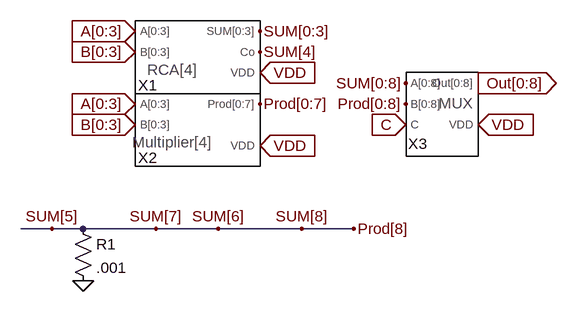
[diagram p0: schematic ALU_ADD_MUL.asc]
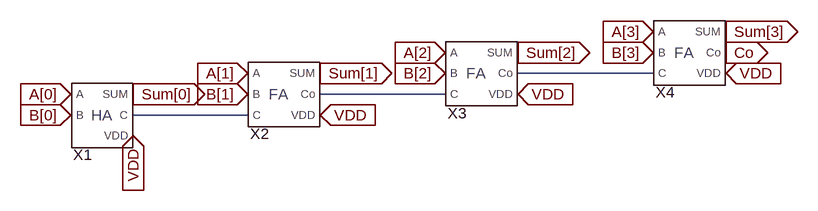
[diagram p1: sub-circuit rca[4].asc]
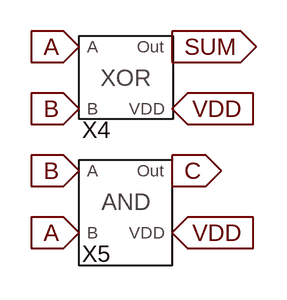
[diagram p2: sub-circuit half_adder.asc]
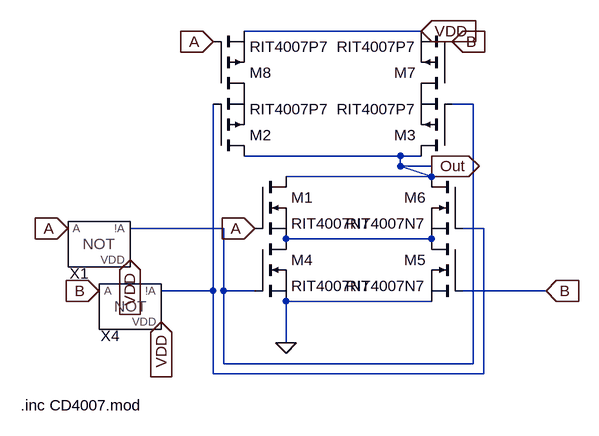
[diagram p3: sub-circuit gate_xor.asc]
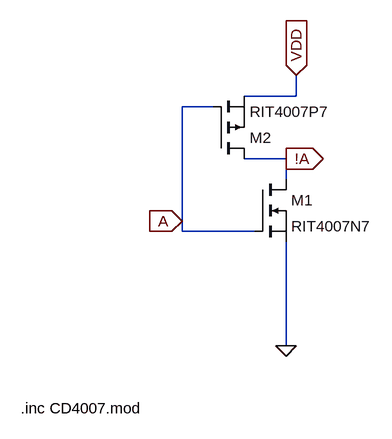
[diagram p4: sub-circuit gate_not.asc]
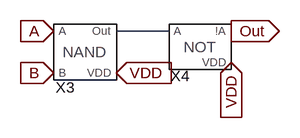
[diagram p5: sub-circuit gate_and.asc]
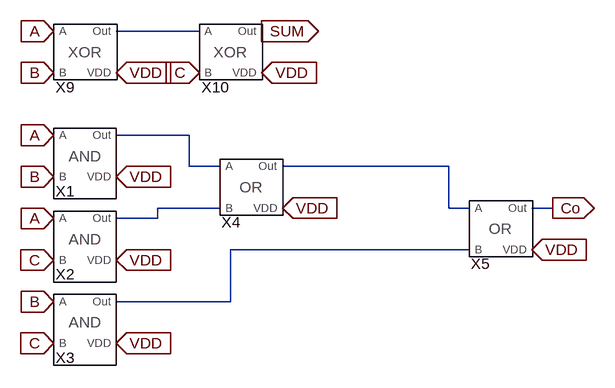
[diagram p6: sub-circuit full_adder.asc]
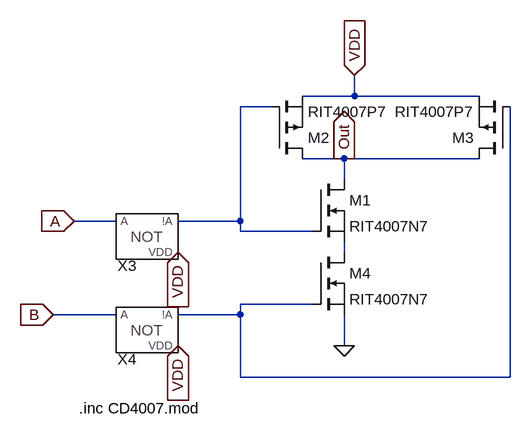
[diagram p7: sub-circuit gate_or.asc]
ALU_ADD_MUL.asc, the LTspice schematic file:
Version 4
SHEET 1 900 1320
WIRE 80 624 32 624
WIRE 128 624 80 624
WIRE 240 624 128 624
WIRE 336 624 240 624
WIRE 464 624 336 624
WIRE 544 624 464 624
FLAG 208 320 A[0:3]
IOPIN 208 320 In
FLAG 208 432 A[0:3]
IOPIN 208 432 In
FLAG 208 464 B[0:3]
IOPIN 208 464 In
FLAG 208 352 B[0:3]
IOPIN 208 352 In
FLAG 400 496 VDD
IOPIN 400 496 In
FLAG 400 384 VDD
IOPIN 400 384 In
FLAG 400 320 SUM[0:3]
FLAG 400 352 SUM[4]
FLAG 736 464 VDD
IOPIN 736 464 In
FLAG 624 464 C
IOPIN 624 464 In
FLAG 624 400 SUM[0:8]
FLAG 736 400 Out[0:8]
IOPIN 736 400 Out
FLAG 128 704 0
FLAG 544 624 Prod[8]
FLAG 400 432 Prod[0:7]
FLAG 624 432 Prod[0:8]
FLAG 80 624 SUM[5]
FLAG 336 624 SUM[6]
FLAG 240 624 SUM[7]
FLAG 464 624 SUM[8]
SYMBOL RCA[4] 272 352 R0
SYMATTR InstName X1
SYMBOL Multiplier[4] 272 464 R0
SYMATTR InstName X2
SYMBOL MUX[9] 672 432 R0
SYMATTR InstName X3
SYMBOL res 112 608 R0
SYMATTR InstName R1
SYMATTR Value .001

rca[4].asc, the sub-circuit schematic file:
Version 4
SHEET 1 880 680
WIRE 432 -64 224 -64
WIRE 112 -32 -80 -32
WIRE -192 0 -368 0
FLAG -464 -32 A[0]
IOPIN -464 -32 In
FLAG -464 0 B[0]
IOPIN -464 0 In
FLAG -192 -32 B[1]
IOPIN -192 -32 In
FLAG -192 -64 A[1]
IOPIN -192 -64 In
FLAG 112 -64 B[2]
IOPIN 112 -64 In
FLAG 112 -96 A[2]
IOPIN 112 -96 In
FLAG 432 -96 B[3]
IOPIN 432 -96 In
FLAG 432 -128 A[3]
IOPIN 432 -128 In
FLAG -368 32 VDD
IOPIN -368 32 In
FLAG -80 0 VDD
IOPIN -80 0 In
FLAG 224 -32 VDD
IOPIN 224 -32 In
FLAG 544 -64 VDD
IOPIN 544 -64 In
FLAG -368 -32 Sum[0]
IOPIN -368 -32 Out
FLAG -80 -64 Sum[1]
IOPIN -80 -64 Out
FLAG 224 -96 Sum[2]
IOPIN 224 -96 Out
FLAG 544 -128 Sum[3]
IOPIN 544 -128 Out
FLAG 544 -96 Co
IOPIN 544 -96 Out
SYMBOL Half_Adder -416 0 R0
SYMATTR InstName X1
SYMBOL Full_Adder -144 -32 R0
SYMATTR InstName X2
SYMBOL Full_Adder 160 -64 R0
SYMATTR InstName X3
SYMBOL Full_Adder 480 -96 R0
SYMATTR InstName X4

half_adder.asc, the sub-circuit schematic file:
Version 4
SHEET 1 880 680
FLAG -160 -48 A
IOPIN -160 -48 In
FLAG -160 16 B
IOPIN -160 16 In
FLAG -160 80 B
IOPIN -160 80 In
FLAG -160 144 A
IOPIN -160 144 In
FLAG -64 -48 SUM
IOPIN -64 -48 Out
FLAG -64 80 C
IOPIN -64 80 Out
FLAG -64 16 VDD
IOPIN -64 16 In
FLAG -64 144 VDD
IOPIN -64 144 In
SYMBOL Gate_XOR -112 -16 R0
SYMATTR InstName X4
SYMBOL Gate_AND -112 112 R0
SYMATTR InstName X5

gate_xor.asc, the sub-circuit schematic file:
Version 4
SHEET 1 880 680
WIRE 256 -208 -16 -208
WIRE 336 -96 304 -96
WIRE 224 -16 -16 -16
WIRE 256 -16 224 -16
WIRE 224 0 224 -16
WIRE 272 0 224 0
WIRE 272 16 224 0
WIRE 272 16 48 16
WIRE -48 96 -192 96
WIRE 352 96 320 96
WIRE 272 112 48 112
WIRE -64 192 -64 -96
WIRE -64 192 -144 192
WIRE -48 192 -48 96
WIRE 0 192 -48 192
WIRE 448 192 320 192
WIRE 272 208 48 208
WIRE 48 272 48 208
WIRE -48 304 -48 192
WIRE 336 304 336 -96
WIRE 336 304 -48 304
WIRE -64 320 -64 192
WIRE 352 320 352 96
WIRE 352 320 -64 320
FLAG 48 272 0
FLAG 256 -208 VDD
IOPIN 256 -208 In
FLAG -240 192 B
IOPIN -240 192 In
FLAG -288 96 A
IOPIN -288 96 In
FLAG 304 -192 B
IOPIN 304 -192 In
FLAG 0 96 A
IOPIN 0 96 In
FLAG 448 192 B
IOPIN 448 192 In
FLAG -64 -192 A
IOPIN -64 -192 In
FLAG 272 0 Out
IOPIN 272 0 Out
FLAG -192 144 VDD
IOPIN -192 144 In
FLAG -144 240 VDD
IOPIN -144 240 In
SYMBOL nmos 0 16 R0
SYMATTR InstName M1
SYMATTR Value RIT4007N7
SYMBOL pmos -64 -16 M180
SYMATTR InstName M2
SYMATTR Value RIT4007P7
SYMBOL pmos 304 -16 R180
SYMATTR InstName M3
SYMATTR Value RIT4007P7
SYMBOL nmos 0 112 R0
SYMATTR InstName M4
SYMATTR Value RIT4007N7
SYMBOL nmos 320 112 M0
SYMATTR InstName M5
SYMATTR Value RIT4007N7
SYMBOL nmos 320 16 M0
SYMATTR InstName M6
SYMATTR Value RIT4007N7
SYMBOL pmos 304 -112 R180
SYMATTR InstName M7
SYMATTR Value RIT4007P7
SYMBOL pmos -64 -112 M180
SYMATTR InstName M8
SYMATTR Value RIT4007P7
SYMBOL Gate_NOT -240 128 R0
SYMATTR InstName X1
SYMBOL Gate_NOT -192 224 R0
SYMATTR InstName X4
TEXT -360 368 Left 2 !.inc CD4007.mod

gate_not.asc, the sub-circuit schematic file:
Version 4
SHEET 1 880 680
WIRE 64 -112 64 -144
WIRE 64 -112 -16 -112
WIRE -64 -96 -112 -96
WIRE 48 -16 -16 -16
WIRE 48 16 48 -16
WIRE -112 80 -112 -96
WIRE -112 96 -112 80
WIRE 0 96 -112 96
WIRE 48 272 48 112
FLAG 48 272 0
FLAG -112 80 A
IOPIN -112 80 In
FLAG 48 -16 !A
IOPIN 48 -16 Out
FLAG 64 -144 VDD
IOPIN 64 -144 In
SYMBOL nmos 0 16 R0
SYMATTR InstName M1
SYMATTR Value RIT4007N7
SYMBOL pmos -64 -16 M180
SYMATTR InstName M2
SYMATTR Value RIT4007P7
TEXT -360 368 Left 2 !.inc CD4007.mod

gate_and.asc, the sub-circuit schematic file:
Version 4
SHEET 1 880 680
WIRE -144 0 -224 0
FLAG -224 64 VDD
IOPIN -224 64 In
FLAG -48 48 VDD
IOPIN -48 48 In
FLAG -320 64 B
IOPIN -320 64 In
FLAG -320 0 A
IOPIN -320 0 In
FLAG -48 0 Out
IOPIN -48 0 Out
SYMBOL Gate_NAND -272 32 R0
SYMATTR InstName X3
SYMBOL Gate_NOT -96 32 R0
SYMATTR InstName X4

full_adder.asc, the sub-circuit schematic file:
Version 4
SHEET 1 880 680
WIRE -224 -64 -352 -64
WIRE -240 96 -352 96
WIRE -240 144 -240 96
WIRE -192 144 -240 144
WIRE 160 144 -96 144
WIRE -192 208 -288 208
WIRE 160 208 160 144
WIRE 192 208 160 208
WIRE 320 208 288 208
WIRE -288 224 -288 208
WIRE -288 224 -352 224
WIRE 192 272 -176 272
WIRE -176 352 -176 272
WIRE -176 352 -352 352
FLAG -448 -64 A
IOPIN -448 -64 In
FLAG -448 0 B
IOPIN -448 0 In
FLAG -224 0 C
IOPIN -224 0 In
FLAG -352 0 VDD
IOPIN -352 0 In
FLAG -128 0 VDD
IOPIN -128 0 In
FLAG -128 -64 SUM
IOPIN -128 -64 Out
FLAG -352 160 VDD
IOPIN -352 160 In
FLAG -352 288 VDD
IOPIN -352 288 In
FLAG -352 416 VDD
IOPIN -352 416 In
FLAG -448 96 A
IOPIN -448 96 In
FLAG -448 160 B
IOPIN -448 160 In
FLAG -448 224 A
IOPIN -448 224 In
FLAG -448 288 C
IOPIN -448 288 In
FLAG -448 416 C
IOPIN -448 416 In
FLAG -448 352 B
IOPIN -448 352 In
FLAG -96 208 VDD
IOPIN -96 208 In
FLAG 288 272 VDD
IOPIN 288 272 In
FLAG 320 208 Co
IOPIN 320 208 Out
SYMBOL Gate_XOR -400 -32 R0
SYMATTR InstName X9
SYMBOL Gate_XOR -176 -32 R0
SYMATTR InstName X10
SYMBOL Gate_AND -400 128 R0
SYMATTR InstName X1
SYMBOL Gate_AND -400 256 R0
SYMATTR InstName X2
SYMBOL Gate_AND -400 384 R0
SYMATTR InstName X3
SYMBOL Gate_OR -144 176 R0
SYMATTR InstName X4
SYMBOL Gate_OR 240 240 R0
SYMATTR InstName X5

gate_or.asc, the sub-circuit schematic file:
Version 4
SHEET 1 880 680
WIRE 64 -112 64 -144
WIRE 64 -112 -16 -112
WIRE 256 -112 64 -112
WIRE -64 -96 -112 -96
WIRE 48 -16 -16 -16
WIRE 256 -16 48 -16
WIRE 48 16 48 -16
WIRE -304 80 -368 80
WIRE -112 80 -112 -96
WIRE -112 80 -208 80
WIRE -112 96 -112 80
WIRE 0 96 -112 96
WIRE 48 128 48 112
WIRE 0 208 -112 208
WIRE -304 224 -400 224
WIRE -112 224 -112 208
WIRE -112 224 -208 224
WIRE 48 272 48 224
WIRE -112 320 -112 224
WIRE 304 320 304 -96
WIRE 304 320 -112 320
FLAG 48 272 0
FLAG -368 80 A
IOPIN -368 80 In
FLAG -400 224 B
IOPIN -400 224 In
FLAG 48 -16 Out
IOPIN 48 -16 Out
FLAG 64 -144 VDD
IOPIN 64 -144 In
FLAG -208 128 VDD
IOPIN -208 128 In
FLAG -208 272 VDD
IOPIN -208 272 In
SYMBOL nmos 0 16 R0
SYMATTR InstName M1
SYMATTR Value RIT4007N7
SYMBOL pmos -64 -16 M180
SYMATTR InstName M2
SYMATTR Value RIT4007P7
SYMBOL pmos 304 -16 R180
SYMATTR InstName M3
SYMATTR Value RIT4007P7
SYMBOL nmos 0 128 R0
SYMATTR InstName M4
SYMATTR Value RIT4007N7
SYMBOL Gate_NOT -256 112 R0
SYMATTR InstName X3
SYMBOL Gate_NOT -256 256 R0
SYMATTR InstName X4
TEXT -360 368 Left 2 !.inc CD4007.mod

multiplier[4].asc, the sub-circuit schematic file:
Version 4
SHEET 1 892 1308
WIRE -384 -80 -416 -80
WIRE -160 -80 -176 -80
WIRE 80 -80 64 -80
WIRE -688 80 -736 80
WIRE -448 80 -496 80
WIRE -208 80 -256 80
WIRE 16 80 -16 80
WIRE 80 224 80 -80
WIRE 128 224 80 224
WIRE 16 256 16 80
WIRE 128 256 16 256
WIRE 320 256 224 256
WIRE -688 288 -688 80
WIRE -608 288 -688 288
WIRE -464 288 -512 288
WIRE -384 288 -384 -80
WIRE -352 288 -384 288
WIRE -176 288 -240 288
WIRE -160 288 -160 -80
WIRE -112 288 -160 288
WIRE 32 288 0 288
WIRE -608 320 -640 320
WIRE -496 320 -512 320
WIRE -448 320 -448 80
WIRE -352 320 -448 320
WIRE -224 320 -240 320
WIRE -208 320 -208 80
WIRE -112 320 -208 320
WIRE 80 320 0 320
WIRE -352 352 -368 352
WIRE -112 352 -128 352
WIRE -496 416 -496 320
WIRE -496 416 -896 416
WIRE -128 416 -128 352
WIRE 320 416 320 256
WIRE 320 416 -128 416
WIRE -368 432 -368 352
WIRE 80 432 80 320
WIRE 80 432 -368 432
WIRE -640 448 -640 320
WIRE -224 448 -224 320
WIRE -224 448 -640 448
WIRE -944 496 -976 496
WIRE -656 496 -736 496
WIRE -432 496 -496 496
WIRE -16 496 -256 496
WIRE -432 624 -432 496
WIRE -208 624 -432 624
WIRE 32 624 32 288
WIRE 96 624 32 624
WIRE -16 656 -16 496
WIRE 96 656 -16 656
WIRE 304 656 192 656
WIRE -896 688 -896 416
WIRE -832 688 -896 688
WIRE -944 720 -944 496
WIRE -832 720 -944 720
WIRE -464 720 -464 288
WIRE -352 720 -464 720
WIRE -176 720 -176 288
WIRE -112 720 -176 720
WIRE -832 752 -848 752
WIRE -656 752 -656 496
WIRE -352 752 -656 752
WIRE -224 752 -240 752
WIRE -208 752 -208 624
WIRE -112 752 -208 752
WIRE 80 752 0 752
WIRE -352 784 -384 784
WIRE -112 784 -128 784
WIRE -128 848 -128 784
WIRE 304 848 304 656
WIRE 304 848 -128 848
WIRE -384 864 -384 784
WIRE 80 864 80 752
WIRE 80 864 -384 864
WIRE -848 896 -848 752
WIRE -224 896 -224 752
WIRE -224 896 -848 896
FLAG 64 -16 VDD
IOPIN 64 -16 In
FLAG 304 -16 VDD
IOPIN 304 -16 In
FLAG -176 -16 VDD
IOPIN -176 -16 In
FLAG -416 -16 VDD
IOPIN -416 -16 In
FLAG -512 -80 A[0]
IOPIN -512 -80 In
FLAG -512 -16 B[3]
IOPIN -512 -16 In
FLAG -272 -80 A[0]
IOPIN -272 -80 In
FLAG -32 -80 A[0]
IOPIN -32 -80 In
FLAG -32 -16 B[1]
IOPIN -32 -16 In
FLAG -272 -16 B[2]
IOPIN -272 -16 In
FLAG 208 -80 A[0]
IOPIN 208 -80 In
FLAG 208 -16 B[0]
IOPIN 208 -16 In
FLAG -256 144 VDD
IOPIN -256 144 In
FLAG -16 144 VDD
IOPIN -16 144 In
FLAG -496 144 VDD
IOPIN -496 144 In
FLAG -736 144 VDD
IOPIN -736 144 In
FLAG -832 80 A[1]
IOPIN -832 80 In
FLAG -832 144 B[3]
IOPIN -832 144 In
FLAG -592 80 A[1]
IOPIN -592 80 In
FLAG -352 80 A[1]
IOPIN -352 80 In
FLAG -352 144 B[1]
IOPIN -352 144 In
FLAG -592 144 B[2]
IOPIN -592 144 In
FLAG -112 80 A[1]
IOPIN -112 80 In
FLAG -112 144 B[0]
IOPIN -112 144 In
FLAG 304 -80 Prod[0]
IOPIN 304 -80 Out
FLAG 224 224 Prod[1]
IOPIN 224 224 Out
FLAG 224 288 VDD
IOPIN 224 288 In
FLAG 0 352 VDD
IOPIN 0 352 In
FLAG -240 352 VDD
IOPIN -240 352 In
FLAG -512 352 VDD
IOPIN -512 352 In
FLAG -496 560 VDD
IOPIN -496 560 In
FLAG -256 560 VDD
IOPIN -256 560 In
FLAG -736 560 VDD
IOPIN -736 560 In
FLAG -976 560 VDD
IOPIN -976 560 In
FLAG -1072 496 A[2]
IOPIN -1072 496 In
FLAG -1072 560 B[3]
IOPIN -1072 560 In
FLAG -832 496 A[2]
IOPIN -832 496 In
FLAG -592 496 A[2]
IOPIN -592 496 In
FLAG -592 560 B[1]
IOPIN -592 560 In
FLAG -832 560 B[2]
IOPIN -832 560 In
FLAG -352 496 A[2]
IOPIN -352 496 In
FLAG -352 560 B[0]
IOPIN -352 560 In
FLAG -752 992 VDD
IOPIN -752 992 In
FLAG -512 992 VDD
IOPIN -512 992 In
FLAG -992 992 VDD
IOPIN -992 992 In
FLAG -1232 992 VDD
IOPIN -1232 992 In
FLAG -1328 928 A[3]
IOPIN -1328 928 In
FLAG -1328 992 B[3]
IOPIN -1328 992 In
FLAG -848 992 B[1]
IOPIN -848 992 In
FLAG -1088 992 B[2]
IOPIN -1088 992 In
FLAG -608 992 B[0]
IOPIN -608 992 In
FLAG -432 1136 Prod[3:6]
IOPIN -432 1136 Out
FLAG -432 1168 Prod[7]
IOPIN -432 1168 Out
FLAG -432 1200 VDD
IOPIN -432 1200 In
FLAG -624 1168 PB[0:3]
FLAG -624 1136 PA[0:3]
FLAG -512 928 PB[0]
FLAG -752 928 PB[1]
FLAG -992 928 PB[2]
FLAG -1232 928 PB[3]
FLAG -1088 928 A[3]
IOPIN -1088 928 In
FLAG -848 928 A[3]
IOPIN -848 928 In
FLAG -608 928 A[3]
IOPIN -608 928 In
FLAG 192 688 VDD
IOPIN 192 688 In
FLAG 192 624 Prod[2]
IOPIN 192 624 Out
FLAG 0 720 PA[0]
FLAG 0 784 VDD
IOPIN 0 784 In
FLAG -240 784 VDD
IOPIN -240 784 In
FLAG -240 720 PA[1]
FLAG -720 752 VDD
IOPIN -720 752 In
FLAG -720 688 PA[2]
FLAG -720 720 PA[3]
SYMBOL Gate_AND -464 -48 R0
SYMATTR InstName X1
SYMBOL Gate_AND -224 -48 R0
SYMATTR InstName X2
SYMBOL Gate_AND 16 -48 R0
SYMATTR InstName X3
SYMBOL Gate_AND 256 -48 R0
SYMATTR InstName X4
SYMBOL Gate_AND -784 112 R0
SYMATTR InstName X5
SYMBOL Gate_AND -544 112 R0
SYMATTR InstName X6
SYMBOL Gate_AND -304 112 R0
SYMATTR InstName X7
SYMBOL Gate_AND -64 112 R0
SYMATTR InstName X8
SYMBOL Half_Adder 176 256 R0
SYMATTR InstName X9
SYMBOL Full_Adder -64 320 R0
SYMATTR InstName X10
SYMBOL Full_Adder -304 320 R0
SYMATTR InstName X11
SYMBOL Gate_AND -1024 528 R0
SYMATTR InstName X13
SYMBOL Gate_AND -784 528 R0
SYMATTR InstName X14
SYMBOL Gate_AND -544 528 R0
SYMATTR InstName X15
SYMBOL Gate_AND -304 528 R0
SYMATTR InstName X16
SYMBOL Gate_AND -1280 960 R0
SYMATTR InstName X17
SYMBOL Gate_AND -1040 960 R0
SYMATTR InstName X18
SYMBOL Gate_AND -800 960 R0
SYMATTR InstName X19
SYMBOL Gate_AND -560 960 R0
SYMATTR InstName X20
SYMBOL RCA[4] -560 1168 R0
SYMATTR InstName X21
SYMBOL Half_Adder 144 656 R0
SYMATTR InstName X22
SYMBOL Full_Adder -64 752 R0
SYMATTR InstName X23
SYMBOL Full_Adder -304 752 R0
SYMATTR InstName X24
SYMBOL Half_Adder -560 320 R0
SYMATTR InstName X12
SYMBOL Full_Adder -784 720 R0
SYMATTR InstName X25

mux[9].asc, the sub-circuit schematic file:
Version 4
SHEET 1 880 1320
FLAG 432 160 Out[0]
IOPIN 432 160 Out
FLAG 432 224 VDD
IOPIN 432 224 In
FLAG 320 160 A[0]
IOPIN 320 160 In
FLAG 320 192 B[0]
IOPIN 320 192 In
FLAG 320 224 C
IOPIN 320 224 In
FLAG 432 288 Out[1]
IOPIN 432 288 Out
FLAG 432 352 VDD
IOPIN 432 352 In
FLAG 320 288 A[1]
IOPIN 320 288 In
FLAG 320 320 B[1]
IOPIN 320 320 In
FLAG 320 352 C
IOPIN 320 352 In
FLAG 432 416 Out[2]
IOPIN 432 416 Out
FLAG 432 480 VDD
IOPIN 432 480 In
FLAG 320 416 A[2]
IOPIN 320 416 In
FLAG 320 448 B[2]
IOPIN 320 448 In
FLAG 320 480 C
IOPIN 320 480 In
FLAG 432 544 Out[3]
IOPIN 432 544 Out
FLAG 432 608 VDD
IOPIN 432 608 In
FLAG 320 544 A[3]
IOPIN 320 544 In
FLAG 320 576 B[3]
IOPIN 320 576 In
FLAG 320 608 C
IOPIN 320 608 In
FLAG 432 672 Out[4]
IOPIN 432 672 Out
FLAG 432 736 VDD
IOPIN 432 736 In
FLAG 320 672 A[4]
IOPIN 320 672 In
FLAG 320 704 B[4]
IOPIN 320 704 In
FLAG 320 736 C
IOPIN 320 736 In
FLAG 432 800 Out[5]
IOPIN 432 800 Out
FLAG 432 864 VDD
IOPIN 432 864 In
FLAG 320 800 A[5]
IOPIN 320 800 In
FLAG 320 832 B[5]
IOPIN 320 832 In
FLAG 320 864 C
IOPIN 320 864 In
FLAG 432 928 Out[6]
IOPIN 432 928 Out
FLAG 432 992 VDD
IOPIN 432 992 In
FLAG 320 928 A[6]
IOPIN 320 928 In
FLAG 320 960 B[6]
IOPIN 320 960 In
FLAG 320 992 C
IOPIN 320 992 In
FLAG 432 1056 Out[7]
IOPIN 432 1056 Out
FLAG 432 1120 VDD
IOPIN 432 1120 In
FLAG 320 1056 A[7]
IOPIN 320 1056 In
FLAG 320 1088 B[7]
IOPIN 320 1088 In
FLAG 320 1120 C
IOPIN 320 1120 In
FLAG 432 1184 Out[8]
IOPIN 432 1184 Out
FLAG 432 1248 VDD
IOPIN 432 1248 In
FLAG 320 1184 A[8]
IOPIN 320 1184 In
FLAG 320 1216 B[8]
IOPIN 320 1216 In
FLAG 320 1248 C
IOPIN 320 1248 In
SYMBOL MUX 368 192 R0
SYMATTR InstName X1
SYMBOL MUX 368 320 R0
SYMATTR InstName X2
SYMBOL MUX 368 448 R0
SYMATTR InstName X3
SYMBOL MUX 368 576 R0
SYMATTR InstName X4
SYMBOL MUX 368 704 R0
SYMATTR InstName X5
SYMBOL MUX 368 832 R0
SYMATTR InstName X6
SYMBOL MUX 368 960 R0
SYMATTR InstName X7
SYMBOL MUX 368 1088 R0
SYMATTR InstName X8
SYMBOL MUX 368 1216 R0
SYMATTR InstName X9

mux.asc, the sub-circuit schematic file:
Version 4
SHEET 1 880 680
WIRE 288 112 224 112
WIRE 288 160 288 112
WIRE 336 160 288 160
WIRE 336 224 224 224
WIRE 128 288 112 288
FLAG 128 112 B
IOPIN 128 112 In
FLAG 128 176 C
IOPIN 128 176 In
FLAG 224 176 VDD
IOPIN 224 176 In
FLAG 128 224 A
IOPIN 128 224 In
FLAG 16 288 C
IOPIN 16 288 In
FLAG 224 288 VDD
IOPIN 224 288 In
FLAG 112 336 VDD
IOPIN 112 336 In
FLAG 432 160 Out
IOPIN 432 160 Out
FLAG 432 224 VDD
IOPIN 432 224 In
SYMBOL Gate_AND 176 144 R0
SYMATTR InstName X1
SYMBOL Gate_AND 176 256 R0
SYMATTR InstName X3
SYMBOL Gate_NOT 64 320 R0
SYMATTR InstName X4
SYMBOL Gate_OR 384 192 R0
SYMATTR InstName X5

The netlist it stands for:
* ALU_ADD_MUL.asc
XX1 A[0] A[1] A[2] A[3] VDD SUM[0] SUM[1] SUM[2] SUM[3] B[0] B[1] B[2] B[3] SUM[4] rca[4]
XX2 A[0] A[1] A[2] A[3] VDD Prod[0] Prod[1] Prod[2] Prod[3] Prod[4] Prod[5] Prod[6] Prod[7] B[0] B[1] B[2] B[3] multiplier[4]
XX3 SUM[0] SUM[1] SUM[2] SUM[3] SUM[4] SUM[5] SUM[6] SUM[7] SUM[8] Prod[0] Prod[1] Prod[2] Prod[3] Prod[4] Prod[5] Prod[6] Prod[7] Prod[8] C VDD Out[0] Out[1] Out[2] Out[3] Out[4] Out[5] Out[6] Out[7] Out[8] mux[9]
R1 SUM[8] 0 .001

* block symbol definitions
.subckt rca[4] A[0] A[1] A[2] A[3] VDD SUM[0] SUM[1] SUM[2] SUM[3] B[0] B[1] B[2] B[3] Co
XX1 A[0] VDD Sum[0] B[0] N003 half_adder
XX2 A[1] VDD Sum[1] B[1] N002 N003 full_adder
XX3 A[2] VDD Sum[2] B[2] N001 N002 full_adder
XX4 A[3] VDD Sum[3] B[3] Co N001 full_adder
.ends rca[4]

.subckt half_adder A VDD SUM B C
XX4 A B SUM VDD gate_xor
XX5 B A C VDD gate_and
.ends half_adder

.subckt gate_xor A B Out VDD
M1 Out A N003 N003 RIT4007N7
M2 Out N002 P001 P001 RIT4007P7
M3 Out N001 P002 P002 RIT4007P7
M4 N003 N001 0 0 RIT4007N7
M5 N003 B 0 0 RIT4007N7
M6 Out N002 N003 N003 RIT4007N7
M7 P002 B VDD VDD RIT4007P7
M8 P001 A VDD VDD RIT4007P7
XX1 A VDD N001 gate_not
XX4 B VDD N002 gate_not
.inc CD4007.mod
.ends gate_xor

.subckt gate_not A VDD !A
M1 !A A 0 0 RIT4007N7
M2 !A A VDD VDD RIT4007P7
.inc CD4007.mod
.ends gate_not

.subckt gate_and A B Out VDD
XX3 A B N001 VDD Gate_NAND  ; pins A B Out VDD
XX4 N001 VDD Out gate_not
.ends gate_and

.subckt full_adder A VDD SUM B Co C
XX9 A B N001 VDD gate_xor
XX10 N001 C SUM VDD gate_xor
XX1 A B N002 VDD gate_and
XX2 A C N004 VDD gate_and
XX3 B C N005 VDD gate_and
XX4 N002 N004 N003 VDD gate_or
XX5 N003 N005 Co VDD gate_or
.ends full_adder

.subckt gate_or A B Out VDD
M1 Out N001 N002 N002 RIT4007N7
M2 Out N001 VDD VDD RIT4007P7
M3 Out N003 VDD VDD RIT4007P7
M4 N002 N003 0 0 RIT4007N7
XX3 A VDD N001 gate_not
XX4 B VDD N003 gate_not
.inc CD4007.mod
.ends gate_or

.subckt multiplier[4] A[0] A[1] A[2] A[3] VDD Prod[0] Prod[1] Prod[2] Prod[3] Prod[4] Prod[5] Prod[6] Prod[7] B[0] B[1] B[2] B[3]
XX1 A[0] B[3] N001 VDD gate_and
XX2 A[0] B[2] N002 VDD gate_and
XX3 A[0] B[1] N003 VDD gate_and
XX4 A[0] B[0] Prod[0] VDD gate_and
XX5 A[1] B[3] N004 VDD gate_and
XX6 A[1] B[2] N005 VDD gate_and
XX7 A[1] B[1] N006 VDD gate_and
XX8 A[1] B[0] N007 VDD gate_and
XX9 N003 VDD Prod[1] N007 N008 half_adder
XX10 N002 VDD N011 N006 N014 N008 full_adder
XX11 N001 VDD N010 N005 N012 N014 full_adder
XX13 A[2] B[3] N015 VDD gate_and
XX14 A[2] B[2] N016 VDD gate_and
XX15 A[2] B[1] N017 VDD gate_and
XX16 A[2] B[0] N018 VDD gate_and
XX17 A[3] B[3] PB[3] VDD gate_and
XX18 A[3] B[2] PB[2] VDD gate_and
XX19 A[3] B[1] PB[1] VDD gate_and
XX20 A[3] B[0] PB[0] VDD gate_and
XX21 PA[0] PA[1] PA[2] PA[3] VDD Prod[3] Prod[4] Prod[5] Prod[6] PB[0] PB[1] PB[2] PB[3] Prod[7] rca[4]
XX22 N011 VDD Prod[2] N018 N019 half_adder
XX23 N010 VDD PA[0] N017 N021 N019 full_adder
XX24 N009 VDD PA[1] N016 N020 N021 full_adder
XX12 N004 VDD N009 N012 N013 half_adder
XX25 N013 VDD PA[2] N015 PA[3] N020 full_adder
.ends multiplier[4]

.subckt mux[9] A[0] A[1] A[2] A[3] A[4] A[5] A[6] A[7] A[8] B[0] B[1] B[2] B[3] B[4] B[5] B[6] B[7] B[8] C VDD Out[0] Out[1] Out[2] Out[3] Out[4] Out[5] Out[6] Out[7] Out[8]
XX1 A[0] B[0] C VDD Out[0] mux
XX2 A[1] B[1] C VDD Out[1] mux
XX3 A[2] B[2] C VDD Out[2] mux
XX4 A[3] B[3] C VDD Out[3] mux
XX5 A[4] B[4] C VDD Out[4] mux
XX6 A[5] B[5] C VDD Out[5] mux
XX7 A[6] B[6] C VDD Out[6] mux
XX8 A[7] B[7] C VDD Out[7] mux
XX9 A[8] B[8] C VDD Out[8] mux
.ends mux[9]

.subckt mux A B C VDD Out
XX1 B C N001 VDD gate_and
XX3 A N003 N002 VDD gate_and
XX4 C VDD N003 gate_not
XX5 N001 N002 Out VDD gate_or
.ends mux

.model NMOS NMOS
.model PMOS PMOS
.lib standard.mos
.backanno
.end